# Altium schematic sheet Variable_Gain_Amplifier.SchDoc: AusBubble : Logic & RF : Variable Gain Amplifier
size A4; DrawnBy: WR, ND; DocumentNumber: 4; Revision: A; SheetNumber: 4; SheetTotal: 6
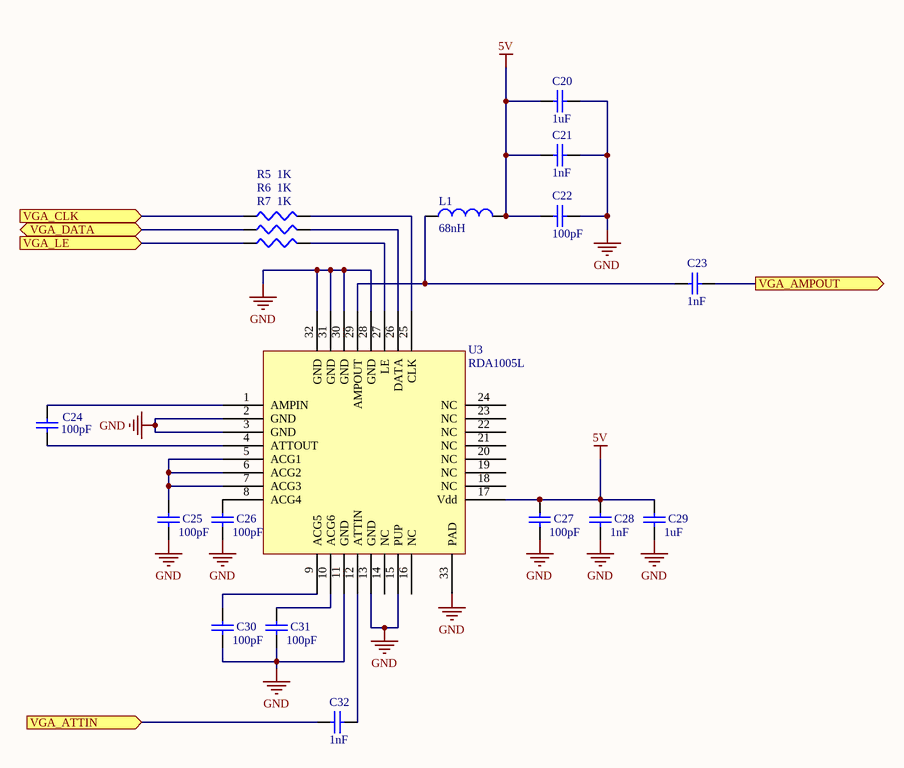
[diagram p0: Variable_Gain_Amplifier.SchDoc]

## Parts
C20  value 1uF  [1608[0603]]  (hidden comment: Cap Semi)
C21  value 1nF  [1608[0603]]  (hidden comment: Cap Semi)
C22  value 100pF  [1608[0603]]  (hidden comment: Cap Semi)
C23  value 1nF  [1608[0603]]  (hidden comment: Cap Semi)
C24  value 100pF  [1608[0603]]  (hidden comment: Cap Semi)
C25  value 100pF  [1608[0603]]  (hidden comment: Cap Semi)
C26  value 100pF  [1608[0603]]  (hidden comment: Cap Semi)
C27  value 100pF  [1608[0603]]  (hidden comment: Cap Semi)
C28  value 1nF  [1608[0603]]  (hidden comment: Cap Semi)
C29  value 1uF  [1608[0603]]  (hidden comment: Cap Semi)
C30  value 100pF  [1608[0603]]  (hidden comment: Cap Semi)
C31  value 100pF  [1608[0603]]  (hidden comment: Cap Semi)
C32  value 1nF  [1608[0603]]  (hidden comment: Cap Semi)
L1  value 68nH  [0603]  (hidden comment: Inductor)
R5  value 1K  [J1-0603]  (hidden comment: Res3)
R6  value 1K  [J1-0603]  (hidden comment: Res3)
R7  value 1K  [J1-0603]  (hidden comment: Res3)
U3  RDA1005L  [QFN50P500X500-32WAL]

## Ports
VGA_AMPOUT (out), VGA_ATTIN (in), VGA_CLK (in), VGA_DATA, VGA_LE (in)

## Nets
5V: C20.2 C21.2 C22.2 C27.2 C28.2 C29.2 L1.2 U3.17(Vdd)
GND: C20.1 C21.1 C22.1 C25.1 C26.1 C27.1 C28.1 C29.1 C30.1 C31.1 U3.2(GND) U3.3(GND) U3.11(GND) U3.13(GND) U3.15(PUP) U3.28(GND) U3.30(GND) U3.31(GND) U3.32(GND) U3.33(PAD)
VGA_AMPOUT: C23.1 ; port VGA_AMPOUT
VGA_ATTIN: C32.2 ; port VGA_ATTIN
VGA_CLK: R5.1 ; port VGA_CLK
VGA_DATA: R6.1 ; port VGA_DATA
VGA_LE: R7.1 ; port VGA_LE
NetC23_2: C23.2 L1.1 U3.29(AMPOUT)
NetC24_1: C24.1 U3.4(ATTOUT)
NetC24_2: C24.2 U3.1(AMPIN)
NetC25_2: C25.2 U3.5(ACG1) U3.6(ACG2) U3.7(ACG3)
NetC26_2: C26.2 U3.8(ACG4)
NetC30_2: C30.2 U3.9(ACG5)
NetC31_2: C31.2 U3.10(ACG6)
NetC32_1: C32.1 U3.12(ATTIN)
NetR5_2: R5.2 U3.25(CLK)
NetR6_2: R6.2 U3.26(DATA)
NetR7_2: R7.2 U3.27(LE)

Not connected (* = marked no-connect by the designer): U3 14(NC) 16(NC) 18(NC) 19(NC) 20(NC) 21(NC) 22(NC) 23(NC) 24(NC)

## Library data of the parts
C20-C32 = Cap Semi: Capacitor (Semiconductor SIM Model); Published: 8-Jun-2000; LatestRevisionDate: 29-May-2009; LatestRevisionNote: IPC-7351 Footprint Added.; PackageReference: C1206; Publisher: Altium Limited; PackageDescription: Chip Capacitor
L1 = Inductor: Code_IEC: 1005; Published: 8-Jun-2000; LatestRevisionDate: 29-May-2009; LatestRevisionNote: IPC-7351 Footprint Added.; PackageReference: 0402-A; Publisher: Altium Limited; PackageDescription: Chip Inductor; Code_JEITA: 0402
R5-R7 = Res3: Resistor; Published: 8-Jun-2000; LatestRevisionDate: 29-May-2009; LatestRevisionNote: IPC-7351 Footprint Added.; PackageReference: J1-0603; Publisher: Altium Limited; PackageDescription: Chip Resistor
U3 = RDA1005L: DIGITAL CONTROLLED VARIABLE GAIN  AMPLIFIER 50 MHZ TO 4000 MHZ, 6 BIT